# EAGLE design probe (EAGLE 6.6.0)
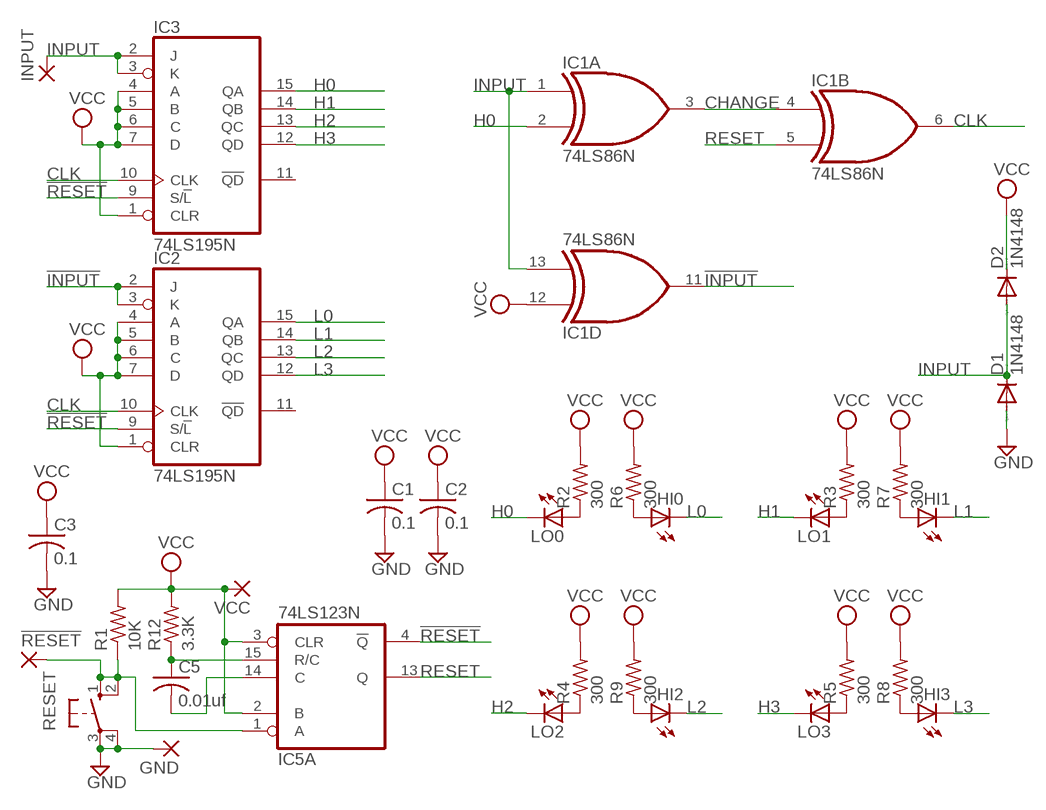
[diagram p0: schematic, sheet 1]

## Parts
!RESET  2,15/1,0  [2,15/1,0]
C1  0.1  C-US050-025X075  [C050-025X075]
C2  0.1  C-US050-025X075  [C050-025X075]
C3  0.1  C-US050-025X075  [C050-025X075]
C5  0.01uf  C-US050-025X075  [C050-025X075]
D1  1N4148  1N4148DO35-10  [DO35-10]
D2  1N4148  1N4148DO35-10  [DO35-10]
GND  2,15/1,0  [2,15/1,0]
HI0  LED3MM  [LED3MM]
HI1  LED3MM  [LED3MM]
HI2  LED3MM  [LED3MM]
HI3  LED3MM  [LED3MM]
IC1  74LS86N  [DIL14]
IC2  74LS195N  [DIL16]
IC3  74LS195N  [DIL16]
IC5  74LS123N  [DIL16]
INPUT  2,15/1,0  [2,15/1,0]
LO0  LED3MM  [LED3MM]
LO1  LED3MM  [LED3MM]
LO2  LED3MM  [LED3MM]
LO3  LED3MM  [LED3MM]
R1  10K  R-US_0207/10  [0207/10]
R2  300  R-US_0207/10  [0207/10]
R3  300  R-US_0207/10  [0207/10]
R4  300  R-US_0207/10  [0207/10]
R5  300  R-US_0207/10  [0207/10]
R6  300  R-US_0207/10  [0207/10]
R7  300  R-US_0207/10  [0207/10]
R8  300  R-US_0207/10  [0207/10]
R9  300  R-US_0207/10  [0207/10]
R12  3.3K  R-US_0207/10  [0207/10]
RESET  40-XX  [B3F-40XX]
VCC  2,15/1,0  [2,15/1,0]

## Nets
!INPUT: IC1.11(D:O) IC2.2(J) IC2.3(K)
!RESET: IC2.9(S/!L) IC3.9(S/!L) IC5.4(A:!Q)
CHANGE: IC1.3(A:O) IC1.4(B:I0)
CLK: IC1.6(B:O) IC2.10(CLK) IC3.10(CLK)
GND: C1.2 C2.2 C3.2 D1.A GND.1(P) RESET.3(P) RESET.4(P1)
H0: IC1.2(A:I1) IC3.15(QA) LO0.K(C)
H1: IC3.14(QB) LO1.K(C)
H2: IC3.13(QC) LO2.K(C)
H3: IC3.12(QD) LO3.K(C)
INPUT: D1.C D2.A IC1.1(A:I0) IC1.13(D:I1) IC3.2(J) IC3.3(K) INPUT.1(P)
L0: HI0.K(C) IC2.15(QA)
L1: HI1.K(C) IC2.14(QB)
L2: HI2.K(C) IC2.13(QC)
L3: HI3.K(C) IC2.12(QD)
N$1: LO0.A R2.1
N$2: LO1.A R3.1
N$3: LO3.A R5.1
N$4: LO2.A R4.1
N$5: HI0.A R6.1
N$6: HI1.A R7.1
N$7: HI3.A R8.1
N$8: HI2.A R9.1
N$14: C5.1 IC5.15(A:R/C) R12.1
N$15: C5.2 IC5.14(A:C)
N$16: !RESET.1(P) IC5.1(A:A) R1.1 RESET.1(S) RESET.2(S1)
RESET: IC1.5(B:I1) IC5.13(A:Q)
VCC: C1.1 C2.1 C3.1 D2.C IC1.12(D:I0) IC2.1(CLR) IC2.4(A) IC2.5(B) IC2.6(C) IC2.7(D) IC3.1(CLR) IC3.4(A) IC3.5(B) IC3.6(C) IC3.7(D) IC5.2(A:B) IC5.3(A:CLR) R1.2 R2.2 R3.2 R4.2 R5.2 R6.2 R7.2 R8.2 R9.2 R12.2 VCC.1(P)
Unconnected: IC1.8(C:O) IC1.9(C:I0) IC1.10(C:I1) IC2.11(!QD) IC3.11(!QD) IC5.5(B:Q) IC5.6(B:C) IC5.7(B:R/C) IC5.9(B:A) IC5.10(B:B) IC5.11(B:CLR) IC5.12(B:!Q)

## Power pins joined to a net without a drawn wire
GND: IC1.7(P:GND) IC2.8(GND) IC3.8(GND) IC5.8(P:GND)
VCC: IC1.14(P:VCC) IC2.16(VCC) IC3.16(VCC) IC5.16(P:VCC)

## Library data of the parts
!RESET GND INPUT VCC = wirepad:2,15/1,0: THROUGH-HOLE PAD
C1-C3 C5 = rcl:C-US: CAPACITOR, American symbol
D1 D2 = diode:1N4148: DIODE high speed (Philips)
HI0 HI1-HI3 LO0 LO1-LO3 = led:LED: LED OSRAM: - CHIPLED LG R971, LG N971, LY N971, LG Q971, LY Q971, LO R971, LY R971 LH N974, LH R974 LS Q976, LO Q976, LY Q976 LO Q996 - Hyper CHIPLED LW Q18S LB Q993, LB Q99A, LB R99A - SideLED LS A670, LO A670, LY A670, LG A670, LP A670 LB A673, LV A673, LT A673, LW A673 LH A674 LY A675 LS A676, LA A676, LO A676, LY A676, LW A676 LS A679, LY A679, LG A679 - Hyper Micro SIDELED® LS Y876, LA Y876, LO Y876, LY Y876 LT Y87S - SmartLED LW L88C, LW L88S LB L89C, LB L89S, LG L890 LS L89K, LO L89K, LY L89K LS L896, LA L896, LO L896, LY L896 - TOPLED LS T670, LO T670, LY T670, LG T670, LP T670 LSG T670, LSP T670, LSY T670, LOP T670, LYG T670 LG T671, LOG T671, LSG T671 LB T673, LV T673, LT T673, LW T673 LH T674 LS T676, LA T676, LO T676, LY T676, LB T676, LH T676, LSB T676, LW T676 LB T67C, LV T67C, LT T67C, LS T67K, LO T67K, LY T67K, LW E67C LS E67B, LA E67B, LO E67B, LY E67B, LB E67C, LV E67C, LT E67C LW T67C LS T679, LY T679, LG T679 LS T770, LO T770, LY T770, LG T770, LP T770 LB T773, LV T773, LT T773, LW T773 LH T774 LS E675, LA E675, LY E675, LS T675 LS T776, LA T776, LO T776, LY T776, LB T776 LHGB T686 LT T68C, LB T68C - Hyper Mini TOPLED® LB M676 - Mini TOPLED Santana® LG M470 LS M47K, LO M47K, LY M47K Source: http://www.osram.convergy.de LUXEON: - LUMILED® LXK2-PW12-R00, LXK2-PW12-S00, LXK2-PW14-U00, LXK2-PW14-V00 LXK2-PM12-R00, LXK2-PM12-S00, LXK2-PM14-U00 LXK2-PE12-Q00, LXK2-PE12-R00, LXK2-PE12-S00, LXK2-PE14-T00, LXK2-PE14-U00 LXK2-PB12-K00, LXK2-PB12-L00, LXK2-PB12-M00, LXK2-PB14-N00, LXK2-PB14-P00, LXK2-PB14-Q00 LXK2-PR12-L00, LXK2-PR12-M00, LXK2-PR14-Q00, LXK2-PR14-R00 LXK2-PD12-Q00, LXK2-PD12-R00, LXK2-PD12-S00 LXK2-PH12-R00, LXK2-PH12-S00 LXK2-PL12-P00, LXK2-PL12-Q00, LXK2-PL12-R00 Source: www.luxeon.com KINGBRIGHT: KA-3528ASYC Source: www.kingbright.com
IC1 = 74xx-us:74*86: Quad 2-input EXCLUSIV-OR (XOR) gate
IC2 IC3 = 74xx-us:74*195: 4-bit parallel access SHIFT REGISTER
IC5 = 74xx-us:74*123: Retriggerable monostable MULTIVIBRATOR
R1-R9 R12 = rcl:R-US_: RESISTOR, American symbol
RESET = switch-omron:40-XX: OMRON SWITCH; MF: OMRON COMPONENTS USA; MPN: B3F-4000; OC_FARNELL: 176434; OC_NEWARK: 36K3105

## Board
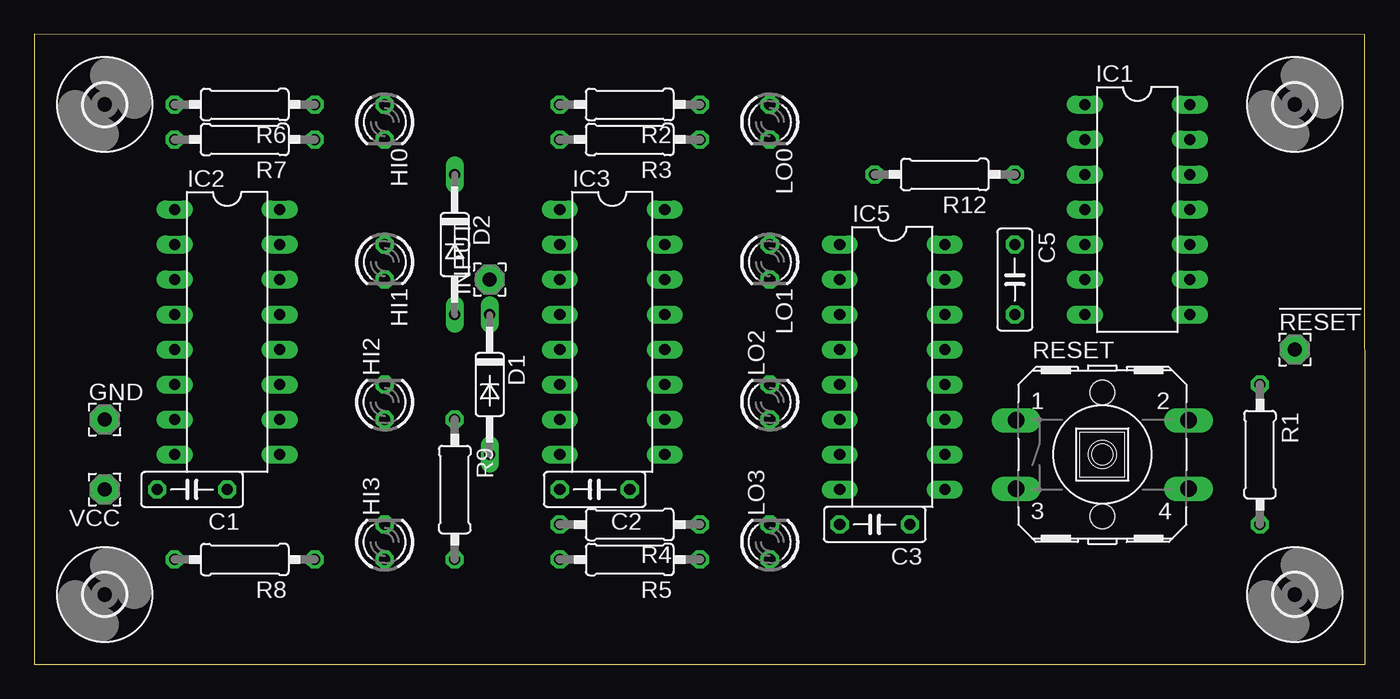
[diagram p1: board, top side]
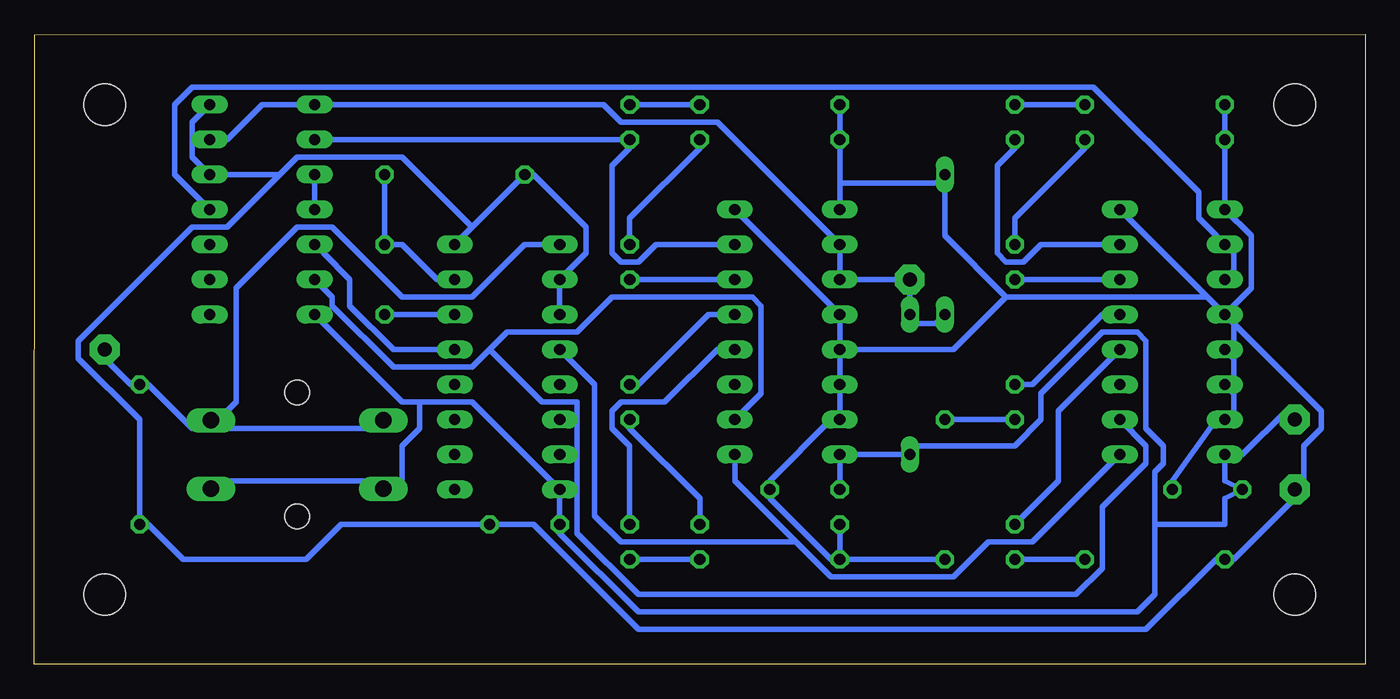
[diagram p2: board, bottom side, seen from below]

Size 96.55 x 45.73 mm. Coordinates in mm from the lower left corner, seen from the top.
Outline: 96.55,0 96.52,45.7 0,45.72 0,0 96.55,0
Copper layers (1+16): Top 0.035mm / dielectric 1.5mm / Bottom 0.035mm
Design rules "16mils": minimum track width 16mil, minimum drill 32mil, track to track 15mil, track to pad 10mil, pad to pad 10mil, via to via 10mil, smd to smd 10mil, copper to edge 13mil, drill to drill 10mil, minimum pad ring 10mil, minimum via ring 8mil, stop-mask expansion 0mil, vias tented up to drill 0mil, thermal gap 10mil

### Footprints (pad centres in the part's own frame; a part is rotated, then mirrored left to right if it is on the bottom)
2,15/1,0 = drill 1.016 pad 2.159 octagon: 1 0,0
C050-025X075 = drill 0.813 octagon: 1 -2.54,0; 2 2.54,0
DO35-10 = drill 0.813 long: A 5.08,0; C -5.08,0
LED3MM = drill 0.813 octagon: A -1.27,0; K 1.27,0
DIL14 = drill 0.813 long: 1 -7.62,-3.81; 2 -5.08,-3.81; 3 -2.54,-3.81; 4 0,-3.81; 5 2.54,-3.81; 6 5.08,-3.81; 7 7.62,-3.81; 8 7.62,3.81; 9 5.08,3.81; 10 2.54,3.81; 11 0,3.81; 12 -2.54,3.81; 13 -5.08,3.81; 14 -7.62,3.81
DIL16 = drill 0.813 long: 1 -8.89,-3.81; 2 -6.35,-3.81; 3 -3.81,-3.81; 4 -1.27,-3.81; 5 1.27,-3.81; 6 3.81,-3.81; 7 6.35,-3.81; 8 8.89,-3.81; 9 8.89,3.81; 10 6.35,3.81; 11 3.81,3.81; 12 1.27,3.81; 13 -1.27,3.81; 14 -3.81,3.81; 15 -6.35,3.81; 16 -8.89,3.81
0207/10 = drill 0.813 octagon: 1 -5.08,0; 2 5.08,0
B3F-40XX = drill 1.194 long: 1 -6.248,2.489; 2 6.248,2.489; 3 -6.248,-2.489; 4 6.248,-2.489 | hole 1.803: 0,-4.496; 0,4.496
3,0 = hole 3: 0,0

### Placement (x,y rotation side)
!RESET  91.45,22.86 0 top
C1  11.44,12.69 180 top
C2  40.65,12.69 180 top
C3  60.97,10.15 180 top
C5  71.13,27.94 270 top
D1  33.03,20.32 270 top
D2  30.49,30.48 270 top
GND  5.09,17.78 0 top
HI0  25.41,39.36 270 top
HI1  25.41,29.21 270 top
HI2  25.41,19.05 90 top
HI3  25.41,8.88 90 top
IC1  80.02,33.02 270 top
IC2  13.98,24.12 270 top
IC3  41.92,24.12 270 top
IC5  62.24,21.59 270 top
INPUT  33.03,27.94 90 top
LO0  53.35,39.36 270 top
LO1  53.35,29.21 270 top
LO2  53.35,19.05 90 top
LO3  53.35,8.88 90 top
R1  88.91,15.23 270 top
R2  43.19,40.63 180 top
R3  43.19,38.09 180 top
R4  43.19,10.15 180 top
R5  43.19,7.62 180 top
R6  15.25,40.63 180 top
R7  15.25,38.09 180 top
R8  15.25,7.62 180 top
R9  30.49,12.69 270 top
R12  66.05,35.55 180 top
RESET  77.48,15.23 0 top
U$1  [3,0]  5.09,40.63 0 top
U$2  [3,0]  91.45,40.63 0 top
U$3  [3,0]  91.45,5.08 0 top
U$4  [3,0]  5.09,5.08 0 top
VCC  5.09,12.69 180 top

### Tracks (layer width: path | path; a pad name or v marks a point on that pad's centre or on a via)
!INPUT
  Bottom 0.406: IC2.3 9.54,28.57 9.54,29.84 IC2.2 10.81,31.11 12.08,32.38 12.08,34.28 19.7,41.9 85.1,41.9 86.37,40.63 86.37,35.55 84.47,33.65 IC1.11
!RESET
  Bottom 0.406: IC2.9 24.14,8.88 27.32,8.88 29.86,6.34 38.75,6.34 41.29,8.88 | 41.29,8.88 45.73,13.33 IC3.9 | IC5.4 55.89,20.32 55.89,10.79 53.99,8.88 41.29,8.88
CHANGE
  Bottom 0.406: IC1.3 IC1.4
CLK
  Bottom 0.406: IC3.10 43.83,19.68 43.83,26.03 44.46,26.67 54.62,26.67 57.16,24.12 62.24,24.12 63.51,22.86 | 63.51,22.86 64.78,21.59 70.5,21.59 74.94,26.03 74.94,26.67 IC1.6 | 63.51,22.86 59.7,19.05 57.16,19.05 57.16,9.52 52.72,5.08 20.97,5.08 19.06,6.98 19.06,11.42 15.89,14.6 15.89,15.87 IC2.10
GND
  Bottom 0.406: RESET.4 82.56,13.33 72.4,13.33 RESET.3 69.86,13.33 69.86,15.87 68.59,17.14 68.59,19.05 | IC1.7 69.86,19.05 68.59,19.05 | 68.59,19.05 64.78,19.05 IC5.8 C3.2 58.43,9.52 52.72,3.81 16.52,3.81 15.25,5.08 15.25,10.15 | C2.2 IC3.8 D1.A 32.4,15.87 25.41,15.87 23.51,17.78 23.51,19.68 19.06,24.12 16.52,24.12 15.89,23.49 15.89,17.14 14.62,15.87 14.62,14.6 15.25,13.96 15.25,10.15 | GND.1 5.73,18.41 8.9,15.23 IC2.8 10.17,13.33 C1.2 10.17,12.06 10.17,10.15 15.25,10.15
H0
  Bottom 0.406: IC3.15 47,30.48 51.45,30.48 52.72,29.21 53.99,29.21 54.62,29.84 54.62,36.19 53.35,37.46 LO0.K 53.99,38.09 74.94,38.09 IC1.2
H1
  Bottom 0.406: IC3.14 47,27.94 52.72,27.94 LO1.K
H2
  Bottom 0.406: LO2.K 52.72,20.32 47.64,25.39 47,25.39 IC3.13
H3
  Bottom 0.406: LO3.K 53.35,10.79 53.35,15.87 54.62,17.14 54.62,18.41 53.99,19.05 50.81,19.05 47,22.86 IC3.12
INPUT
  Bottom 0.406: IC1.13 82.56,38.09 80.02,40.63 IC1.1 55.26,40.63 53.99,39.36 47,39.36 IC3.2 IC3.3 INPUT.1 D1.C 32.4,24.76 31.13,24.76 D2.A
L0
  Bottom 0.406: IC2.15 19.06,30.48 23.51,30.48 24.78,29.21 26.05,29.21 26.68,29.84 26.68,36.19 25.41,37.46 HI0.K
L1
  Bottom 0.406: IC2.14 19.06,27.94 24.78,27.94 HI1.K
L2
  Bottom 0.406: IC2.13 19.06,25.39 24.14,20.32 24.78,20.32 HI2.K
L3
  Bottom 0.406: IC2.12 22.24,18.41 22.24,13.33 HI3.K
N$1
  Bottom 0.406: R2.1 48.91,40.63 52.72,40.63 LO0.A
N$2
  Bottom 0.406: LO1.A 53.35,31.11 53.35,32.38 48.27,37.46 R3.1
N$3
  Bottom 0.406: R5.1 48.91,7.62 52.72,7.62 LO3.A
N$4
  Bottom 0.406: R4.1 48.27,10.79 48.27,12.06 53.35,17.14 LO2.A
N$5
  Bottom 0.406: R6.1 20.97,40.63 24.78,40.63 HI0.A
N$6
  Bottom 0.406: HI1.A 25.41,31.11 25.41,32.38 20.33,37.46 R7.1
N$7
  Bottom 0.406: R8.1 20.97,7.62 24.78,7.62 HI3.A
N$8
  Bottom 0.406: HI2.A 26.05,17.78 29.86,17.78 R9.1
N$14
  Bottom 0.406: IC5.15 67.32,27.94 69.86,30.48 70.5,30.48 C5.1 71.13,31.11 71.13,34.92 R12.1
N$15
  Bottom 0.406: IC5.14 67.32,25.39 70.5,25.39 C5.2
N$16
  Bottom 0.406: !RESET.1 91.45,22.22 89.55,20.32 R1.1 88.28,20.32 85.1,17.14 RESET.2 | IC5.1 59.7,30.48 60.97,30.48 64.78,26.67 69.86,26.67 74.94,31.75 77.48,31.75 81.93,27.3 81.93,19.05 82.56,18.41 RESET.2 | RESET.1 72.4,17.14 82.56,17.14 RESET.2
RESET
  Bottom 0.406: IC5.13 67.32,22.86 70.5,22.86 73.67,26.03 73.67,27.94 75.58,29.84 IC1.5
VCC
  Bottom 0.406: IC1.14 85.1,39.36 85.1,36.82 IC1.12 78.75,35.55 | IC5.3 IC5.2 56.53,29.84 56.53,31.75 60.34,35.55 R12.2 64.78,31.75 | 64.78,31.75 IC5.16 | 78.75,35.55 77.48,36.82 69.86,36.82 64.78,31.75 | 78.75,35.55 82.56,31.75 85.1,31.75 93.36,23.49 93.36,22.22 88.91,17.78 R1.2 88.28,10.15 85.74,7.62 76.85,7.62 74.31,10.15 C3.1 60.34,10.15 52.72,2.54 15.89,2.54 10.81,7.62 R8.2 9.54,7.62 5.09,12.06 VCC.1 4.46,13.33 4.46,15.87 3.19,17.14 3.19,18.41 9.54,24.76 | R5.2 R9.2 | R5.2 R4.2 | R5.2 38.75,7.62 43.19,12.06 C2.1 43.19,13.33 38.75,17.78 IC3.7 IC3.6 IC3.5 | IC3.5 IC3.4 IC3.16 | 38.11,34.92 R3.2 R2.2 | 38.11,34.92 IC3.1 | 38.11,34.92 31.13,34.92 D2.C 30.49,31.11 26.05,26.67 | R6.2 R7.2 IC2.1 8.27,31.11 8.27,27.3 IC2.4 | 9.54,24.76 9.54,23.49 IC2.5 9.54,22.22 9.54,20.95 IC2.6 9.54,19.68 9.54,18.41 IC2.7 10.81,17.78 13.98,13.33 C1.1 | 11.44,26.67 IC2.16 | IC2.4 11.44,26.67 | 9.54,24.76 IC2.4 | 11.44,26.67 26.05,26.67 | IC3.5 29.86,22.86 26.05,26.67